# Altium schematic sheet 28Pins_Schematic.SchDoc (part 1 of 3)
size A2; DocumentNumber: 3; SheetNumber: 1; SheetTotal: 1
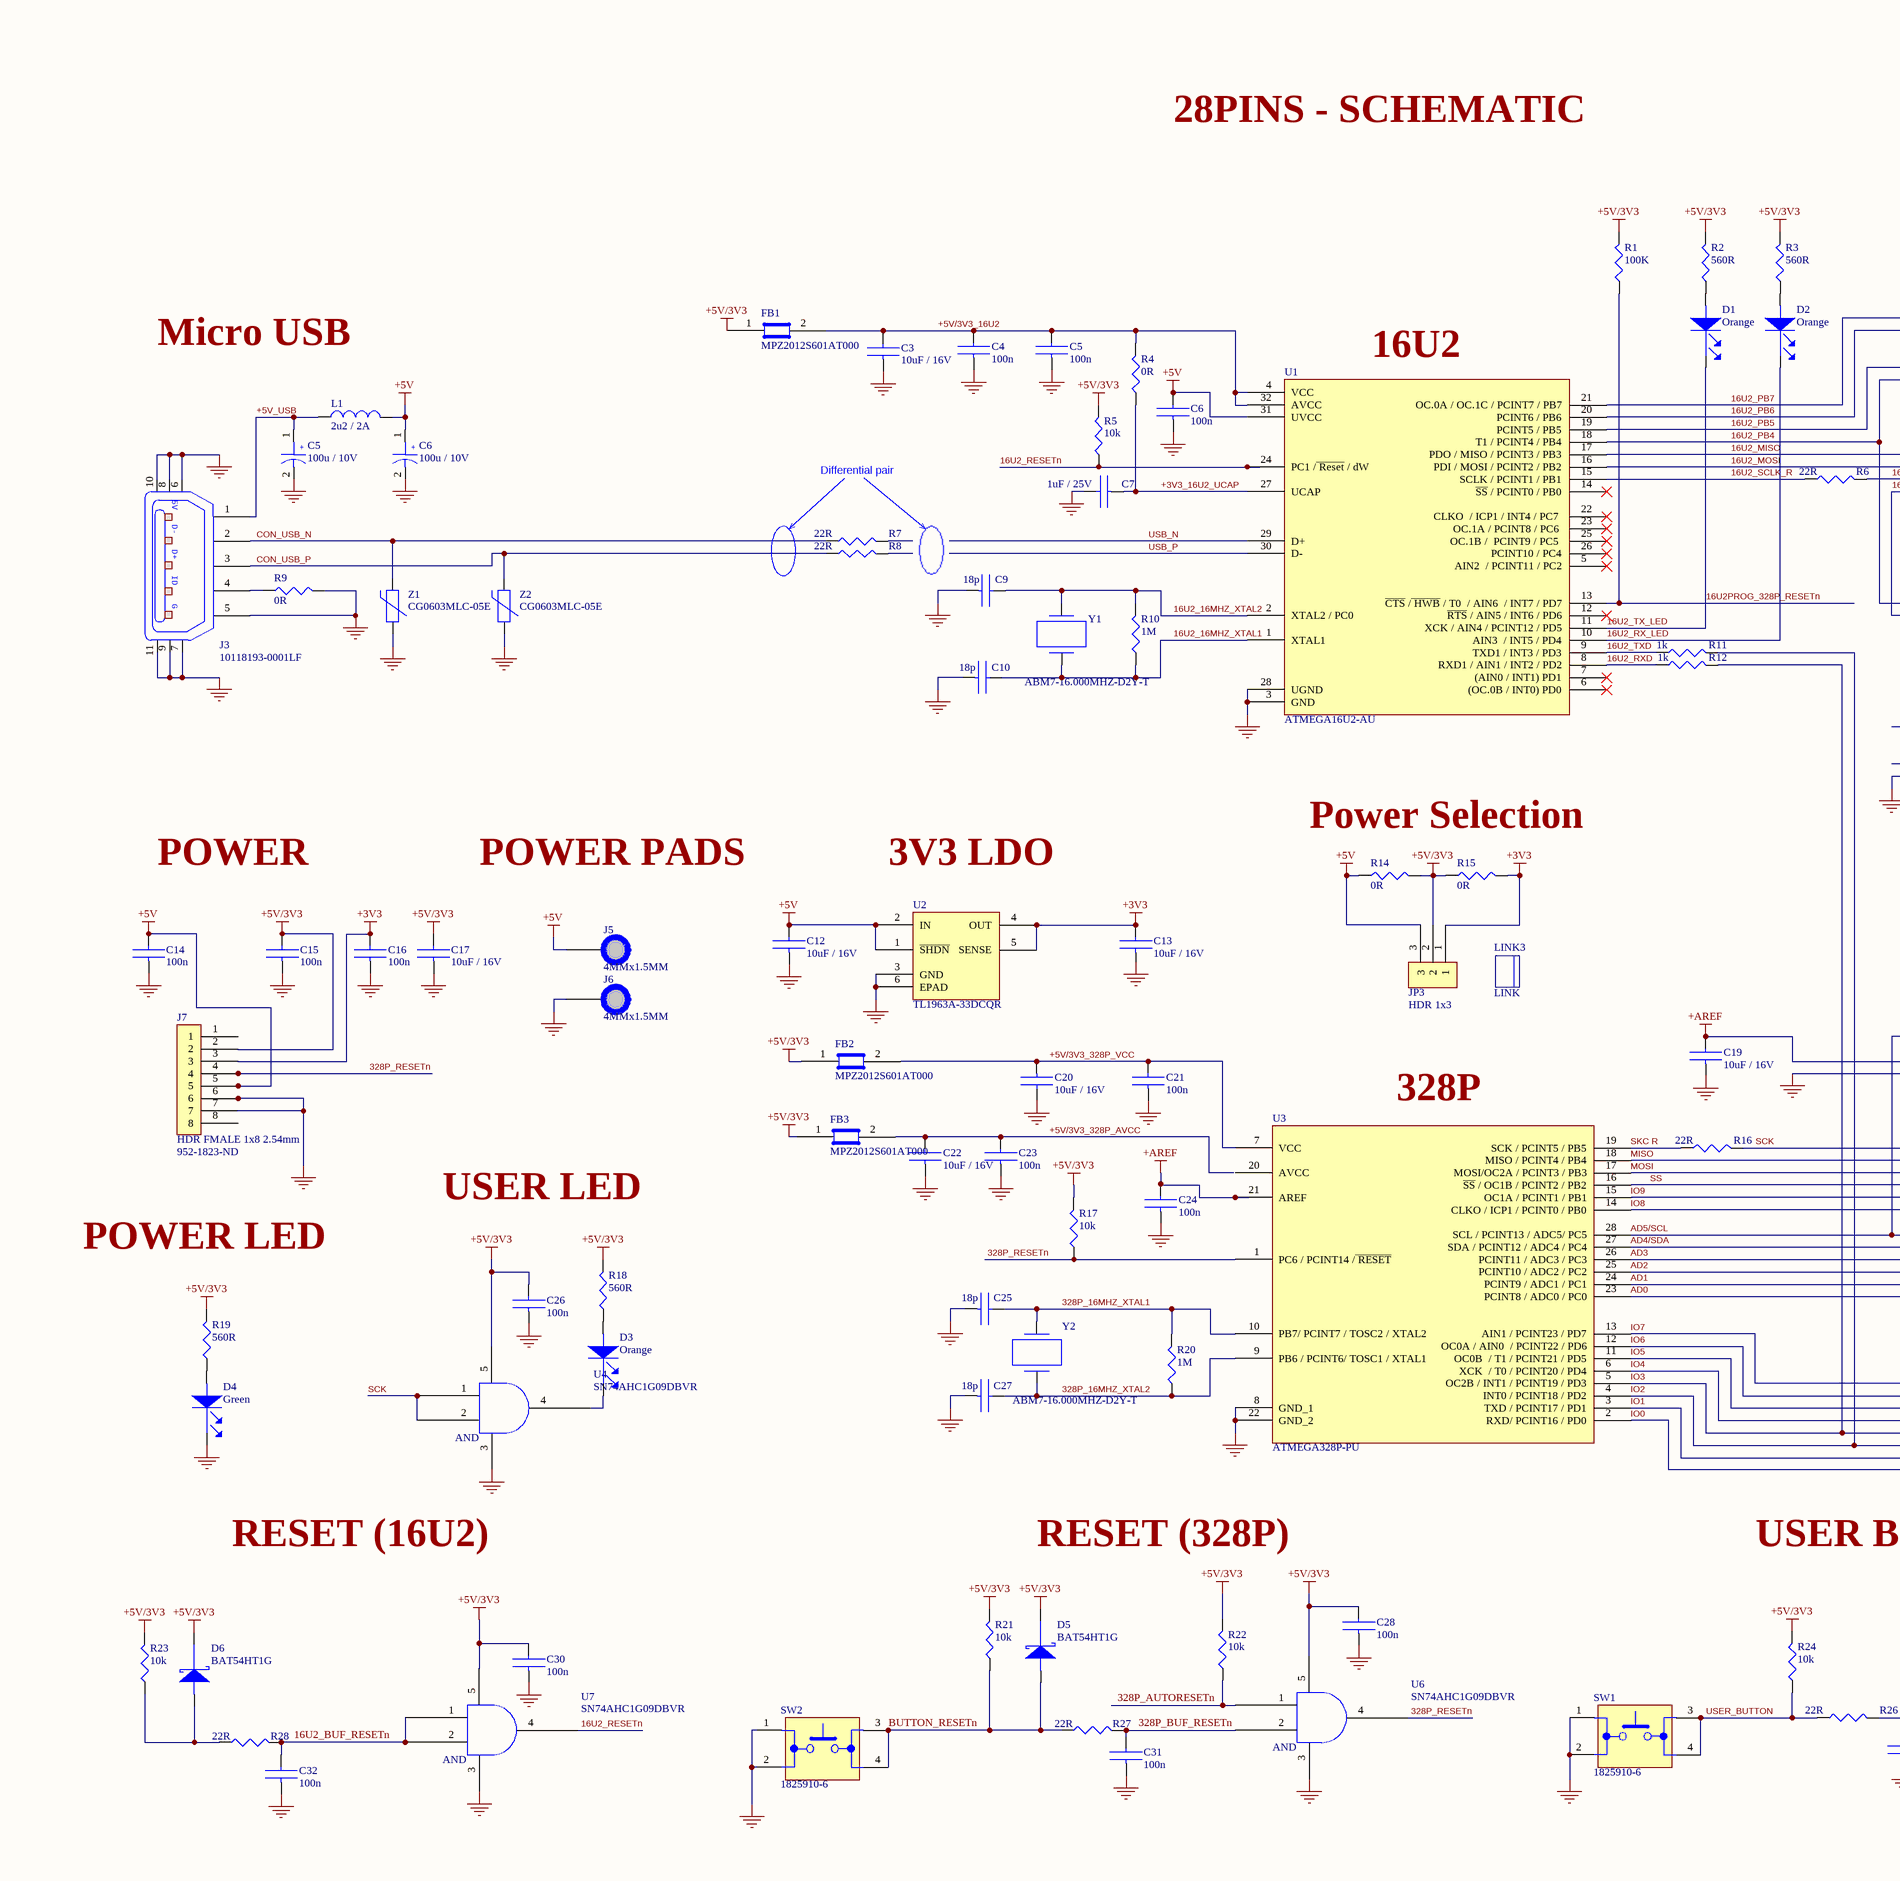
[diagram p0: 28Pins_Schematic.SchDoc, left]
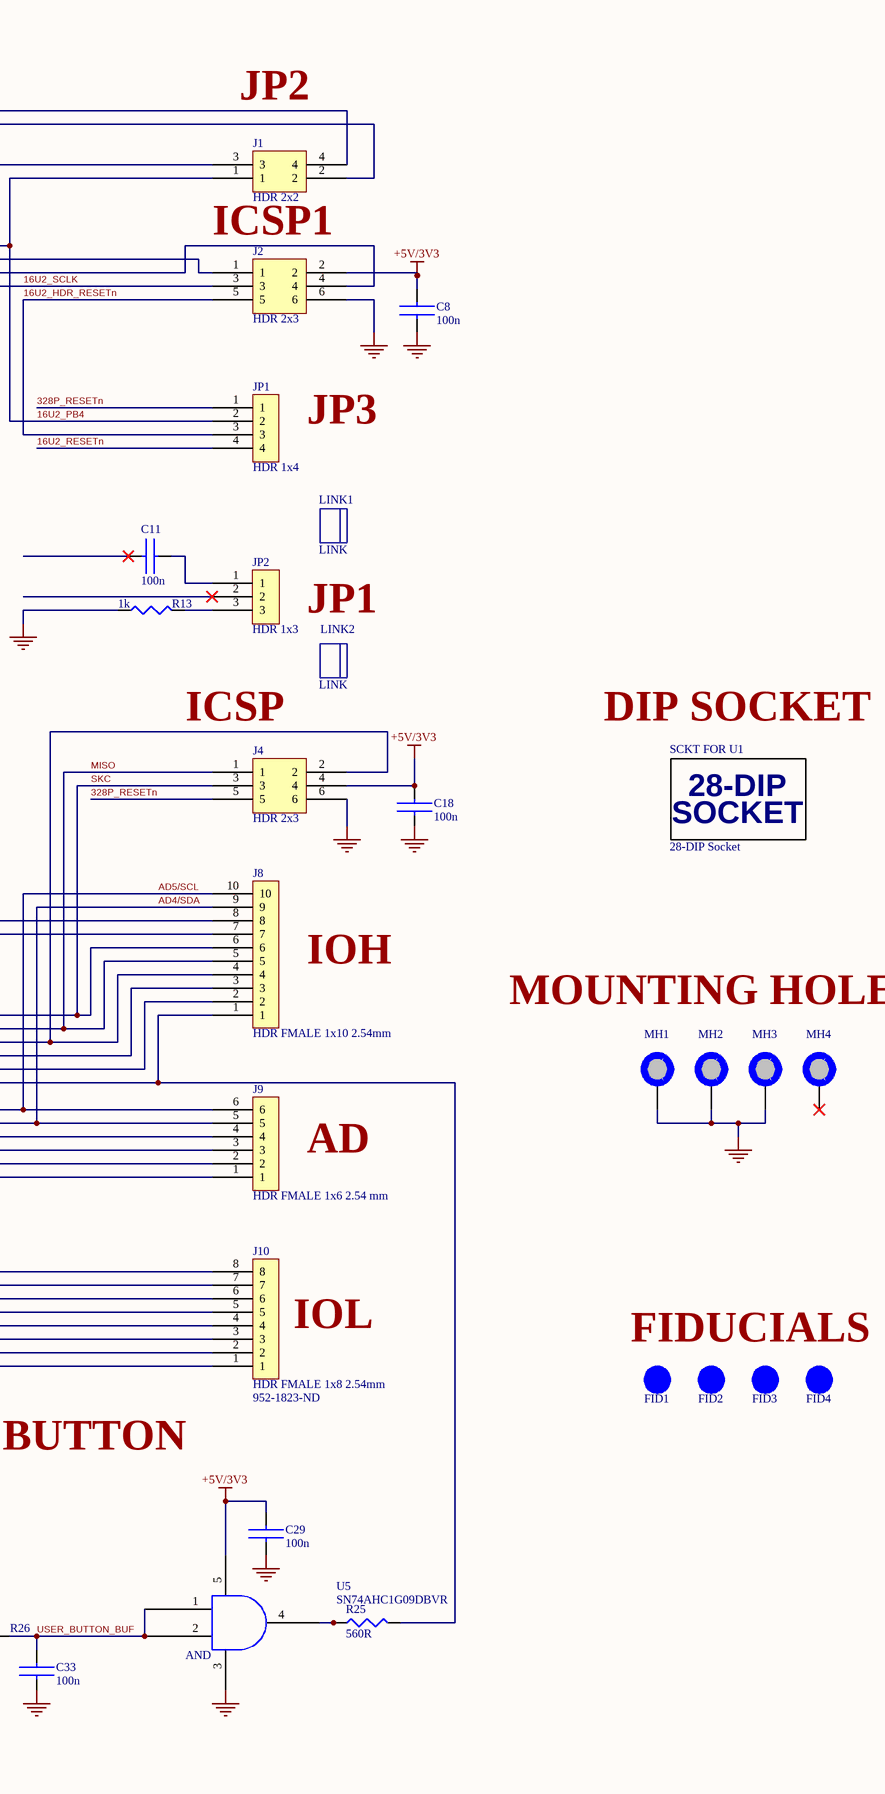
[diagram p1: 28Pins_Schematic.SchDoc, right]

## Parts
(Parts that share a designator on the sheet are numbered #1, #2 ... from top to bottom, then left to right.)
C3  10uF / 16V  [C0805]
C4  100n  [C0805]
C5#1  100n  [C0805]
C5#2  100u / 10V  [C_ALU_C_SIZE]
C6#1  100n  [C0805]
C6#2  100u / 10V  [C_ALU_C_SIZE]
C7  1uF / 25V  [C0805]
C8  100n  [C0805]
C9  18p  [C0805]
C10  18p  [C0805]
C11  100n  [C0805]
C12  10uF / 16V  [C0805]
C13  10uF / 16V  [C0805]
C14  100n  [C0805]
C15  100n  [C0805]
C16  100n  [C0805]
C17  10uF / 16V  [C0805]
C18  100n  [C0805]
C19  10uF / 16V  [C0805]
C20  10uF / 16V  [C0805]
C21  100n  [C0805]
C22  10uF / 16V  [C0805]
C23  100n  [C0805]
C24  100n  [C0805]
C25  18p  [C0805]
C26  100n  [C0805]
C27  18p  [C0805]
C28  100n  [C0805]
C29  100n  [C0805]
C30  100n  [C0805]
C31  100n  [C0805]
C32  100n  [C0805]
C33  100n  [C0805]
D1  Orange  [LED_0603]
D2  Orange  [LED_0603]
D3  Orange  [LED_0603]
D4  Green  [LED_0603]
D5  BAT54HT1G  [SOD323]
D6  BAT54HT1G  [SOD323]
FB1  MPZ2012S601AT000  [C0805]
FB2  MPZ2012S601AT000  [C0805]
FB3  MPZ2012S601AT000  [C0805]
FID1  FID_1MMC  [FID_1MMC]  (value not drawn)  (no BOM)
FID2  FID_1MMC  [FID_1MMC]  (value not drawn)  (no BOM)
FID3  FID_1MMC  [FID_1MMC]  (value not drawn)  (no BOM)
FID4  FID_1MMC  [FID_1MMC]  (value not drawn)  (no BOM)
J1  HDR 2x2  [HDR_2X2_2.54MM]
J2  HDR 2x3  [HDR_2x3_2.54MM]
J3  10118193-0001LF  [10118193]
J4  HDR 2x3  [HDR_2x3_2.54MM]
J5  4MMx1.5MM  [PAD_WITH_HOLE_4MMX1.5MM]  (no BOM)
J6  4MMx1.5MM  [PAD_WITH_HOLE_4MMX1.5MM]  (no BOM)
J7  HDR FMALE 1x8 2.54mm  Supplier Part Number 1: 952-1823-ND  [Hdr_FMALE_1x8_2.54mm]
J8  HDR FMALE 1x10 2.54mm  [Hdr_FMALE_1x10_2.54_mm]
J9  HDR FMALE 1x6 2.54 mm  [Hdr_FMALE_1x6_2.54mm]
J10  HDR FMALE 1x8 2.54mm  Supplier Part Number 1: 952-1823-ND  [Hdr_FMALE_1x8_2.54mm]
JP1  HDR 1x4  [HDR_1x4_2.54MM]
JP2  HDR 1x3  [HDR_MALE-1x3_2.54MM]
JP3  HDR 1x3  [HDR_MALE-1x3_2.54MM]
L1  2u2 / 2A  [C1210_1ND]
LINK1  LINK  (mechanical)
LINK2  LINK  (mechanical)
LINK3  LINK  (mechanical)
MH1  MH_7.4MMC_3.2MMD  [MH_7.4MMC_3.2MMD]  (value not drawn)  (no BOM)
MH2  MH_7.4MMC_3.2MMD  [MH_7.4MMC_3.2MMD]  (value not drawn)  (no BOM)
MH3  MH_7.4MMC_3.2MMD  [MH_7.4MMC_3.2MMD]  (value not drawn)  (no BOM)
MH4  MH_7.4MMC_3.2MMD  [MH_7.4MMC_3.2MMD]  (value not drawn)  (no BOM)
R1  100K  [R0805]
R2  560R  [R0805]
R3  560R  [R0805]
R4  0R  [R0805]
R5  10k
R6  22R  [R0805]
R7  22R  [R0805]
R8  22R  [R0805]
R9  0R  [R0805]
R10  1M  [R0805]
R11  1k  [R0805]
R12  1k  [R0805]
R13  1k  [R0805]
R14  0R  [R0805]
R15  0R  [R0805]
R16  22R  [R0805]
R17  10k
R18  560R  [R0805]
R19  560R  [R0805]
R20  1M  [R0805]
R21  10k
R22  10k
R23  10k
R24  10k
R25  560R  [R0805]
R26  22R  [R0805]
R27  22R  [R0805]
R28  22R  [R0805]
SCKT_FOR_U1  28-DIP Socket  [28_DIP_7.62mm_SOCKET]
SW1  1825910-6  [1825910-6]
SW2  1825910-6  [1825910-6]
U1  ATMEGA16U2-AU  [TQFP32]
U2  TL1963A-33DCQR  [DCQ (R-PDSO-G6)]
U3  ATMEGA328P-PU  [28_DIP_7.62mm]
U4  SN74AHC1G09DBVR  [DBV_SDT_23_5]
U5  SN74AHC1G09DBVR  [DBV_SDT_23_5]
U6  SN74AHC1G09DBVR  [DBV_SDT_23_5]
U7  SN74AHC1G09DBVR  [DBV_SDT_23_5]
Y1  ABM7-16.000MHZ-D2Y-T  [ABM7_v1_1_BIG]
Y2  ABM7-16.000MHZ-D2Y-T  [ABM7_v1_1_BIG]
Z1  CG0603MLC-05E  [R0603]
Z2  CG0603MLC-05E  [R0603]

## Nets
+3V3: C13.1 C16.1 J7.3 JP3.1 R15.2 U2.4(OUT) U2.5(SENSE)
+5V: C6#1.1 C6#2.1 C12.1 C14.1 J5.1(XX) J7.5 JP3.3 L1.1 R14.1 U1.31(UVCC) U2.1(~{SHDN}) U2.2(IN)
+5V/3V3: C8.1 C15.1 C17.1 C18.1 C26.1 C28.1 C29.1 C30.1 D5.1(Cathode) D6.1(Cathode) FB1.1 FB2.1 FB3.1 J2.2 J4.4 JP3.2 R1.2 R2.2 R3.2 R5.2 R14.2 R15.1 R17.2 R18.2 R19.2 R21.2 R22.2 R23.2 R24.2 U4.5 U5.5 U6.5 U7.5
+AREF: C19.1 C24.1 J8.8 U3.21(AREF)
GND: C5#2.2 C6#2.2 C9.1 C10.1 C12.1 C14.1 C15.1 C16.1 C17.1 C20.1 C21.1 C22.1 C23.1 C24.1 C25.1 C27.1 J3.5 J3.6 J3.7 J3.8 J3.9 J3.10 J3.11 J6.1(XX) J7.6 J7.7 R9.2 U1.3(GND) U1.28(UGND) U2.3(GND) U2.6(EPAD) U3.8(GND_1) U3.22(GND_2) Z1.1 Z2.1
NetC3_1: C3.1 C4.1 C5#1.1 C6#1.1 C7.1 C8.1 C19.1 C26.1 C28.1 C29.1 C30.1 C31.1 C32.1 D4.1(Cathode) J2.6 J4.6 J8.7 MH1.1 MH2.1 MH3.1 R13.1 SW1.1 SW1.2 SW2.1 SW2.2 U4.3 U5.3 U6.3 U7.3
16U2_16MHZ_XTAL1: C10.1 R10.1 U1.1(XTAL1) Y1.1
16U2_16MHZ_XTAL2: C9.1 R10.2 U1.2(XTAL2_/_PC0) Y1.2
16U2_BUF_RESETn: C32.1 R28.2 U7.1 U7.2
16U2_HDR_RESETn: J2.5 JP1.3
16U2_MISO: J2.1 U1.17(PDO_/_MISO_/_PCINT3_/_PB3)
16U2_MOSI: J2.4 U1.16(PDI_/_MOSI_/_PCINT2_/_PB2)
16U2_PB4: J1.1 JP1.2 U1.18(T1_/_PCINT4_/_PB4)
16U2_PB5: J1.3 U1.19(PCINT5_/_PB5)
16U2_PB6: J1.2 U1.20(PCINT6_/_PB6)
16U2_PB7: J1.4 U1.21(OC.0A_/_OC.1C_/_PCINT7_/_PB7)
16U2_RESETn: JP1.4 R5.1 U1.24(PC1_/~{_Reset}_/_dW) U7.4
16U2_RX_LED: D2.1(Cathode) U1.10(AIN3__/_INT5_/_PD4)
16U2_RXD: R12.1 U1.8(RXD1_/_AIN1_/_INT2_/_PD2)
16U2_SCLK: J2.3 R6.2
16U2_SCLK_R: R6.1 U1.15(SCLK_/_PCINT1_/_PB1)
16U2_TX_LED: D1.1(Cathode) R1.1 U1.11(XCK_/_AIN4_/_PCINT12_/_PD5) U1.13(~{CTS}_/~{_HWB}_/_T0__/_AIN6__/_INT7_/_PD7)  [also labelled 16U2PROG_328P_RESETn]
16U2_TXD: R11.1 U1.9(TXD1_/_INT3_/_PD3)
328P_16MHZ_XTAL1: C25.1 R20.2 U3.10(PB7/_PCINT7_/_TOSC2_/_XTAL2) Y2.2
328P_16MHZ_XTAL2: C27.1 R20.1 U3.9(PB6_/_PCINT6/_TOSC1_/_XTAL1) Y2.1
328P_AUTORESETn: R22.1 U6.1
328P_BUF_RESETn: C31.1 R27.2 U6.2
328P_RESETn: J4.5 J7.4 JP1.1 R17.1 U3.1(PC6_/_PCINT14_/~{_RESET}) U6.4
+3V3_16U2_UCAP: C7.1 R4.1 U1.27(UCAP)
+5V/3V3_16U2: C3.1 C4.1 C5#1.1 FB1.2 R4.2 U1.4(VCC) U1.32(AVCC)
+5V/3V3_328P_AVCC: C22.1 C23.1 FB3.2
+5V/3V3_328P_VCC: C20.1 C21.1 FB2.2 U3.7(VCC)
+5V_USB: C5#2.1 J3.1 L1.1
AD4/SDA: J8.9 J9.5 U3.27(SDA_/_PCINT12_/_ADC4_/_PC4)
AD5/SCL: J8.10 J9.6 U3.28(SCL_/_PCINT13_/_ADC5/_PC5)
BUTTON_RESETn: D5.2(Anode) R21.1 R27.1 SW2.3 SW2.4
CON_USB_N: J3.2 R7.1 Z1.2
CON_USB_P: J3.3 R8.1 Z2.2
MISO: J4.1 J8.5 U3.18(MISO_/_PCINT4_/_PB4)
SCK: J4.3 J8.6 R16.2 U4.1 U4.2  [also labelled SKC]
SS: J8.3 U3.16(~{SS}_/_OC1B_/_PCINT2_/_PB2)
USB_N: R7.2 U1.29(D+)
USB_P: R8.2 U1.30(D-)
USER_BUTTON: R24.1 R26.1 SW1.3 SW1.4
USER_BUTTON_BUF: C33.1 R26.2 U5.1 U5.2
NetC11_1: C11.1 JP2.1
NetD1_2: D1.2(Anode) R2.1
NetD2_2: D2.2(Anode) R3.1
NetD3_1: D3.1(Cathode) U4.4
NetD3_2: D3.2(Anode) R18.1
NetD4_2: D4.2(Anode) R19.1
NetD6_2: D6.2(Anode) R23.1 R28.1
NetJ3_4: J3.4 R9.1
NetJ4_2: J4.2 J8.4 U3.17(MOSI/OC2A_/_PCINT3_/_PB3)
NetJ8_1: J8.1 R25.2 U3.14(CLKO_/_ICP1_/_PCINT0_/_PB0)
NetJ8_2: J8.2 U3.15(OC1A_/_PCINT1_/_PB1)
NetJ9_1: J9.1 U3.23(PCINT8_/_ADC0_/_PC0)
NetJ9_2: J9.2 U3.24(PCINT9_/_ADC1_/_PC1)
NetJ9_3: J9.3 U3.25(PCINT10_/_ADC2_/_PC2)
NetJ9_4: J9.4 U3.26(PCINT11_/_ADC3_/_PC3)
NetJ10_1: J10.1 U3.2(RXD/_PCINT16_/_PD0)
NetJ10_2: J10.2 U3.3(TXD_/_PCINT17_/_PD1)
NetJ10_3: J10.3 R11.2 U3.4(INT0_/_PCINT18_/_PD2)
NetJ10_4: J10.4 R12.2 U3.5(OC2B_/_INT1_/_PCINT19_/_PD3)
NetJ10_5: J10.5 U3.6(XCK__/_T0_/_PCINT20_/_PD4)
NetJ10_6: J10.6 U3.11(OC0B__/_T1_/_PCINT21_/_PD5)
NetJ10_7: J10.7 U3.12(OC0A_/_AIN0__/_PCINT22_/_PD6)
NetJ10_8: J10.8 U3.13(AIN1_/_PCINT23_/_PD7)
NetJP2_3: JP2.3 R13.2
NetR16_1: R16.1 U3.19(SCK_/_PCINT5_/_PB5)
NetR25_1: R25.1 U5.4

Not connected (* = marked no-connect by the designer): J7 1 2 8; JP2 2*; MH4 1*; U1 5(AIN2__/_PCINT11_/_PC2)* 6((OC.0B_/_INT0)_PD0)* 7((AIN0_/_INT1)_PD1)* 12(~{RTS}_/_AIN5_/_INT6_/_PD6)* 14(~{SS}_/_PCINT0_/_PB0)* 22(CLKO__/_ICP1_/_INT4_/_PC7_)* 23(OC.1A_/_PCINT8_/_PC6_)* 25(OC.1B_/__PCINT9_/_PC5_)* 26(PCINT10_/_PC4)*; U3 20(AVCC)

## Notes on the sheet
- 28PINS - SCHEMATIC
- Micro USB
- JP2
- (near U1) 16U2
- Differential pair
- ICSP1
- JP3
- (near LINK2) JP1
- Power Selection
- POWER
- POWER PADS
- 3V3 LDO
- (near J4) ICSP
- DIP SOCKET
- (near U3) 328P
- IOH
- MOUNTING HOLES
- USER LED
- POWER LED
- AD
- (near J10) IOL
- FIDUCIALS
- RESET (16U2)
- RESET (328P)
- USER BUTTON
- Labels drawn without touching a wire or pin: AD0, AD1, AD2, AD3, AD4/SDA, AD5/SCL, GND, IO0, IO1, IO2, IO3, IO4, IO5, IO6, IO7, IO8, IO9, MISO, MOSI, SKC R
- (in symbol 28-DIP Socket) 28-DIP; SOCKET
- (in symbol 10118193-0001LF) 5V; D-; D+; ID; G
- (in symbol EEE-1AA101WR) +
- (in symbol SN74AHC1G09DBVR) AND